# Altium project UCLA-DRS4-2.1.PrjPCB (part 7 of 7)

## Sheet I2C_ISOLATION.SchDoc: I2C ISOLATION
size OrCAD B; SheetNumber: 31; SheetTotal: 32
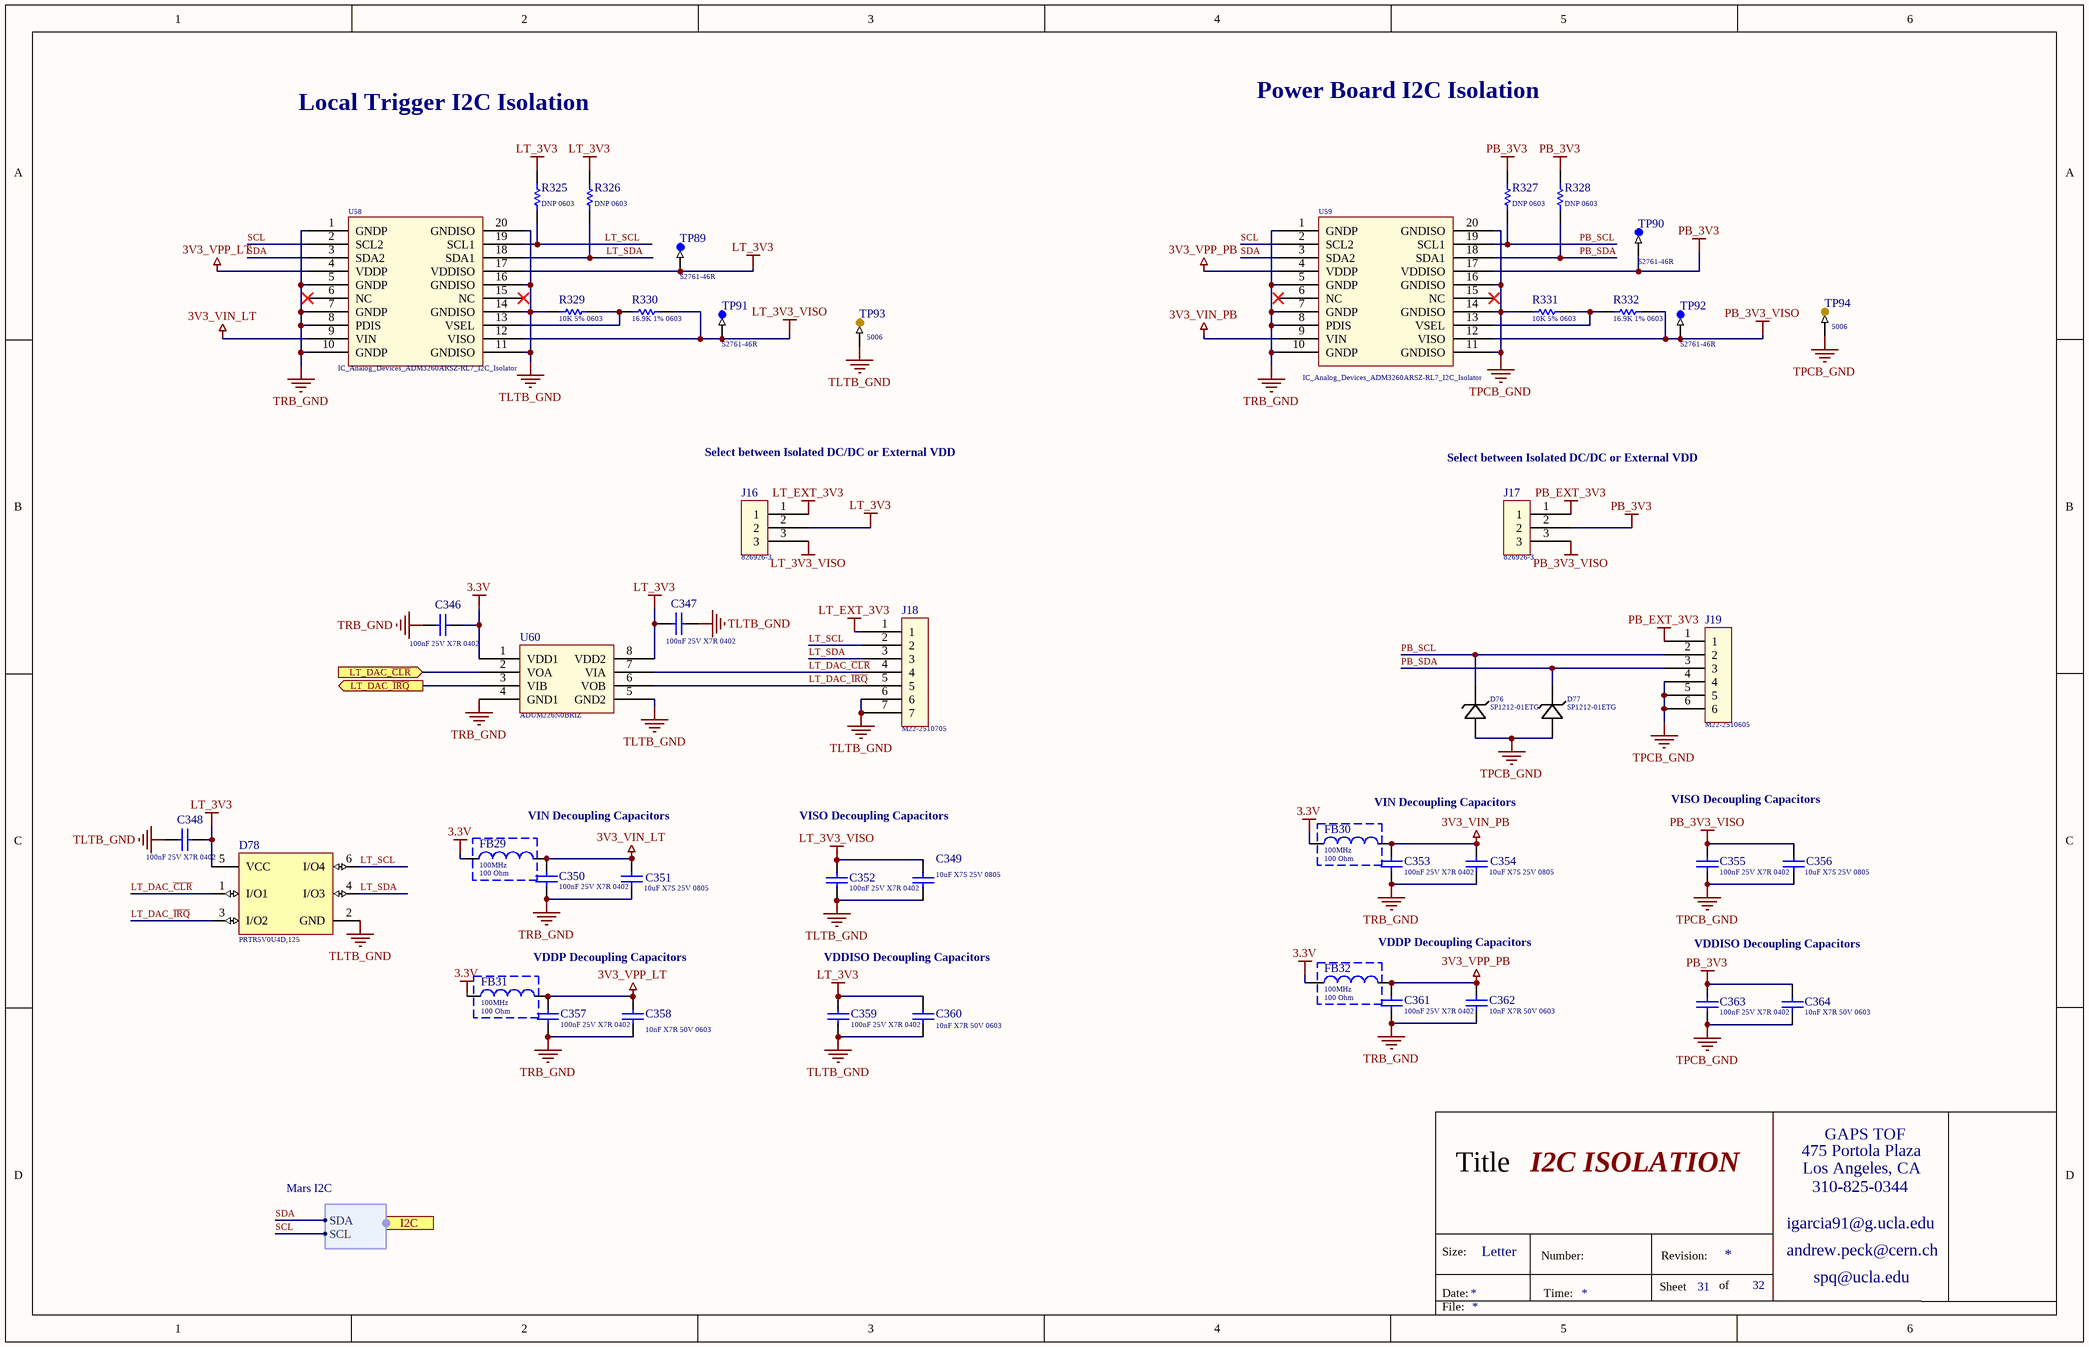
[diagram p29: I2C_ISOLATION.SchDoc]

### Parts
C346  Capacitance: 100nF 25V X7R 0402  [Cap_Taiyo_Yuden_TMK105B7104KV-FR_100nF]  (hidden comment: Cap_Taiyo_Yuden_TMK105B7104KV-FR_100nF)
C347  Capacitance: 100nF 25V X7R 0402  [Cap_Taiyo_Yuden_TMK105B7104KV-FR_100nF]  (hidden comment: Cap_Taiyo_Yuden_TMK105B7104KV-FR_100nF)
C348  Capacitance: 100nF 25V X7R 0402  [Cap_Taiyo_Yuden_TMK105B7104KV-FR_100nF]  (hidden comment: Cap_Taiyo_Yuden_TMK105B7104KV-FR_100nF)
C349  Capacitance: 10uF X7S 25V 0805  [Cap_Murata_ GRM21BC71E106ME11L_10uF]  (hidden comment: Cap_Murata_ GRM21BC71E106ME11L_10uF)
C350  Capacitance: 100nF 25V X7R 0402  [Cap_Taiyo_Yuden_TMK105B7104KV-FR_100nF]  (hidden comment: Cap_Taiyo_Yuden_TMK105B7104KV-FR_100nF)
C351  Capacitance: 10uF X7S 25V 0805  [Cap_Murata_ GRM21BC71E106ME11L_10uF]  (hidden comment: Cap_Murata_ GRM21BC71E106ME11L_10uF)
C352  Capacitance: 100nF 25V X7R 0402  [Cap_Taiyo_Yuden_TMK105B7104KV-FR_100nF]  (hidden comment: Cap_Taiyo_Yuden_TMK105B7104KV-FR_100nF)
C353  Capacitance: 100nF 25V X7R 0402  [Cap_Taiyo_Yuden_TMK105B7104KV-FR_100nF]  (hidden comment: Cap_Taiyo_Yuden_TMK105B7104KV-FR_100nF)
C354  Capacitance: 10uF X7S 25V 0805  [Cap_Murata_ GRM21BC71E106ME11L_10uF]  (hidden comment: Cap_Murata_ GRM21BC71E106ME11L_10uF)
C355  Capacitance: 100nF 25V X7R 0402  [Cap_Taiyo_Yuden_TMK105B7104KV-FR_100nF]  (hidden comment: Cap_Taiyo_Yuden_TMK105B7104KV-FR_100nF)
C356  Capacitance: 10uF X7S 25V 0805  [Cap_Murata_ GRM21BC71E106ME11L_10uF]  (hidden comment: Cap_Murata_ GRM21BC71E106ME11L_10uF)
C357  Capacitance: 100nF 25V X7R 0402  [Cap_Taiyo_Yuden_TMK105B7104KV-FR_100nF]  (hidden comment: Cap_Taiyo_Yuden_TMK105B7104KV-FR_100nF)
C358  Capacitance: 10nF X7R 50V 0603  [Kemet_C0603_0]  (hidden comment: Cap_Kemet_C0603C103J5RACTU_eec)
C359  Capacitance: 100nF 25V X7R 0402  [Cap_Taiyo_Yuden_TMK105B7104KV-FR_100nF]  (hidden comment: Cap_Taiyo_Yuden_TMK105B7104KV-FR_100nF)
C360  Capacitance: 10nF X7R 50V 0603  [Kemet_C0603_0]  (hidden comment: Cap_Kemet_C0603C103J5RACTU_eec)
C361  Capacitance: 100nF 25V X7R 0402  [Cap_Taiyo_Yuden_TMK105B7104KV-FR_100nF]  (hidden comment: Cap_Taiyo_Yuden_TMK105B7104KV-FR_100nF)
C362  Capacitance: 10nF X7R 50V 0603  [Kemet_C0603_0]  (hidden comment: Cap_Kemet_C0603C103J5RACTU_eec)
C363  Capacitance: 100nF 25V X7R 0402  [Cap_Taiyo_Yuden_TMK105B7104KV-FR_100nF]  (hidden comment: Cap_Taiyo_Yuden_TMK105B7104KV-FR_100nF)
C364  Capacitance: 10nF X7R 50V 0603  [Kemet_C0603_0]  (hidden comment: Cap_Kemet_C0603C103J5RACTU_eec)
D76  Series: SP1212-01ETG  [5V_ESD_Littlefuse_SP1212-01ETG_30kV]  (hidden comment: 5V_ESD_Littlefuse_SP1212-01ETG_30kV)
D77  Series: SP1212-01ETG  [5V_ESD_Littlefuse_SP1212-01ETG_30kV]  (hidden comment: 5V_ESD_Littlefuse_SP1212-01ETG_30kV)
D78  PRTR5V0U4D,125  [PRTR5V0U4D,125]
FB29  Measuring Frequency: 100MHz  Impedance: 100 Ohm  [FB_Wurth_Electronics_742792731_100Ohms]  (hidden comment: 742792731)
FB30  Measuring Frequency: 100MHz  Impedance: 100 Ohm  [FB_Wurth_Electronics_742792731_100Ohms]  (hidden comment: 742792731)
FB31  Measuring Frequency: 100MHz  Impedance: 100 Ohm  [FB_Wurth_Electronics_742792731_100Ohms]  (hidden comment: 742792731)
FB32  Measuring Frequency: 100MHz  Impedance: 100 Ohm  [FB_Wurth_Electronics_742792731_100Ohms]  (hidden comment: 742792731)
J16  Series: 826926-3  [Header_TE_Connectivity_826926-3_3POS_5A]  (hidden comment: Header_TE_Connectivity_826926-3_3POS_5A)
J17  Series: 826926-3  [Header_TE_Connectivity_826926-3_3POS_5A]  (hidden comment: Header_TE_Connectivity_826926-3_3POS_5A)
J18  Series: M22-2510705  [Header_Harwin_M22-2510705_7POS]  (hidden comment: Header_Harwin_M22-2510705_7POS)
J19  Series: M22-2510605  [Header_Harwin_ M22-2510605 _6POS]  (hidden comment: Header_Harwin_ M22-2510605 _6POS)
R325  Resistance: DNP 0603  [RES_DNP_0603]  (hidden comment: RES_DNP_0603)
R326  Resistance: DNP 0603  [RES_DNP_0603]  (hidden comment: RES_DNP_0603)
R327  Resistance: DNP 0603  [RES_DNP_0603]  (hidden comment: RES_DNP_0603)
R328  Resistance: DNP 0603  [RES_DNP_0603]  (hidden comment: RES_DNP_0603)
R329  10K 5% 0603  [RESC0603(1608)_L]
R330  Resistance: 16.9K 1% 0603  [Res_Panasonic_ERJ-3EKF1692V_16.9kOhm]  (hidden comment: Res_Panasonic_ERJ-3EKF1692V_16.9kOhm)
R331  10K 5% 0603  [RESC0603(1608)_L]
R332  Resistance: 16.9K 1% 0603  [Res_Panasonic_ERJ-3EKF1692V_16.9kOhm]  (hidden comment: Res_Panasonic_ERJ-3EKF1692V_16.9kOhm)
TP89  Series: S2761-46R  [TP_Harwin_S2761_46R]  (hidden comment: TP_Harwin_S2761_46R)
TP90  Series: S2761-46R  [TP_Harwin_S2761_46R]  (hidden comment: TP_Harwin_S2761_46R)
TP91  Series: S2761-46R  [TP_Harwin_S2761_46R]  (hidden comment: TP_Harwin_S2761_46R)
TP92  Series: S2761-46R  [TP_Harwin_S2761_46R]  (hidden comment: TP_Harwin_S2761_46R)
TP93  Series: 5006  [TP_Keystone_Electronics_5006]  (hidden comment: TP_Keystone_Electronics_5006)
TP94  Series: 5006  [TP_Keystone_Electronics_5006]  (hidden comment: TP_Keystone_Electronics_5006)
U58  IC_Analog_Devices_ADM3260ARSZ-RL7_I2C_Isolator  [IC_Analog_Devices_ADM3260ARSZ-RL7_I2C_Isolator]
U59  IC_Analog_Devices_ADM3260ARSZ-RL7_I2C_Isolator  [IC_Analog_Devices_ADM3260ARSZ-RL7_I2C_Isolator]
U60  Series: ADUM226N0BRIZ  [IC_Analog_Devices_ADUM226N0BRIZ_2CH_Isolator]  (hidden comment: IC_Analog_Devices_ADUM226N0BRIZ_2CH_Isolator)

### Ports
I2C (harness Mars I2C), LT_DAC_~{CLR} (in), LT_DAC_~{IRQ} (out)

### Harnesses
Mars I2C: SCL, SDA

### Nets
3.3V: C346.2 FB29.1 FB30.1 FB31.1 FB32.1 U60.1(VDD1)
3V3_VIN_LT: C350.2 C351.1 FB29.2 U58.9(VIN)
3V3_VIN_PB: C353.2 C354.1 FB30.2 U59.9(VIN)
3V3_VPP_LT: C357.2 C358.1 FB31.2 U58.4(VDDP)
3V3_VPP_PB: C361.2 C362.1 FB32.2 U59.4(VDDP)
LT_3V3: C347.2 C348.1 C359.2 C360.1 D78.5(VCC) J16.2 R325.1 R326.1 TP89.1 U58.17(VDDISO) U60.8(VDD2)
LT_3V3_VISO: C349.1 C352.2 J16.3 R330.1 TP91.1 U58.12(VISO)
LT_EXT_3V3: J16.1 J18.1
PB_3V3: C363.2 C364.1 J17.2 R327.1 R328.1 TP90.1 U59.17(VDDISO)
PB_3V3_VISO: C355.2 C356.1 J17.3 R332.1 TP92.1 U59.12(VISO)
PB_EXT_3V3: J17.1 J19.1
TLTB_GND: C347.1 C348.2 C349.2 C352.1 C359.1 C360.2 D78.2(GND) J18.6 J18.7 R329.1 TP93.1 U58.11(GNDISO) U58.14(GNDISO) U58.16(GNDISO) U58.20(GNDISO) U60.5(GND2)
TPCB_GND: C355.1 C356.2 C363.1 C364.2 D76.2 D77.2 J19.4 J19.5 J19.6 R331.1 TP94.1 U59.11(GNDISO) U59.14(GNDISO) U59.16(GNDISO) U59.20(GNDISO)
TRB_GND: C346.1 C350.1 C351.2 C353.1 C354.2 C357.1 C358.2 C361.1 C362.2 U58.1(GNDP) U58.5(GNDP) U58.7(GNDP) U58.8(PDIS) U58.10(GNDP) U59.1(GNDP) U59.5(GNDP) U59.7(GNDP) U59.8(PDIS) U59.10(GNDP) U60.4(GND1)
DAC_~{CLR}: U60.2(VOA) ; port LT_DAC_~{CLR}
DAC_~{IRQ}: U60.3(VIB) ; port LT_DAC_~{IRQ}
LT_DAC_~{CLR}: D78.1(I/O1) J18.4 U60.7(VIA)
LT_DAC_~{IRQ}: D78.3(I/O2) J18.5 U60.6(VOB)
LT_SCL: D78.6(I/O4) J18.2 R325.2 U58.19(SCL1)
LT_SDA: D78.4(I/O3) J18.3 R326.2 U58.18(SDA1)
PB_SCL: D76.1 J19.2 R327.2 U59.19(SCL1)
PB_SDA: D77.1 J19.3 R328.2 U59.18(SDA1)
SCL: U58.2(SCL2) U59.2(SCL2) ; port I2C.SCL
SDA: U58.3(SDA2) U59.3(SDA2) ; port I2C.SDA
NetR329_2: R329.2 R330.2 U58.13(VSEL)
NetR331_2: R331.2 R332.2 U59.13(VSEL)

Not connected (* = marked no-connect by the designer): U58 6(NC)* 15(NC)*; U59 6(NC)* 15(NC)*

### Notes on the sheet
- Local Trigger I2C Isolation
- Power Board I2C Isolation
- Select between Isolated DC/DC or External VDD
- (near J17) Select between Isolated DC/DC or External VDD
- VIN Decoupling Capacitors
- VISO Decoupling Capacitors
- VDDP Decoupling Capacitors
- VDDISO Decoupling Capacitors
- 475 Portola Plaza
- GAPS TOF
- Title
- igarcia91@g.ucla.edu
- Los Angeles, CA
- 310-825-0344
- Size:
- Date:
- Letter
- Number:
- Time:
- Sheet
- Revision:
- of
- andrew.peck@cern.ch
- spq@ucla.edu
- File:

### Library data of the parts
C346-C348 C350 C352 C353 C355 C357 C359 C361 C363 = Cap_Taiyo_Yuden_TMK105B7104KV-FR_100nF: CAP CER 100nF 25V X7R 0402; Supplier 1: Mouser; Supplier Part Number 1: 963-TMK105B7104KV-FR
C349 C351 C354 C356 = Cap_Murata_ GRM21BC71E106ME11L_10uF: CAP CER 10uF 25V X7R 0805; Supplier 1: Mouser; Supplier Part Number 1: 81-GRM21BC71E106ME1L
C358 C360 C362 C364 = Cap_Kemet_C0603C103J5RACTU_eec: CAP CER 10nF 50V X7R 0603; Manufacturer: Kemet; Mfg Package Ident: C0603; Part Number: C0603C103J5RACTU; helpURL: https://upverter.com/upn/revision/8a8d0c297e33ac74/; ComponentLink2Description: Datasheet; Temperature: -55°C to +125°C; Package: C0603; Supplier 2: Mouser; Price: 0.0184203126773; Supplier 1: Digi-Key; ComponentLink1URL: https://upverter.com/upn/revision/8a8d0c297e33ac74/; Supplier Part Number 2: 80-C0603C103J5R; Supplier Part Number 1: 399-1092-1-ND; Value: 10nF; ComponentLink1Description: Upverter; ComponentLink2URL: https://content.kemet.com/datasheets/KEM_C1002_X7R_SMD.pdf; RoHS: TRUE; Mouser Part Number: 80-C0603C103J5R; Temperature Range High: +125°C; Digikey Description: CAP CER 10000PF 50V X7R 0603; Digikey Part Number: 399-1092-1-ND; Lead Free: yes; Temperature Range Low: -55°C; Voltage: 50V
D76 D77 = 5V_ESD_Littlefuse_SP1212-01ETG_30kV: ESD Suppressors / TVS Diodes 5V 12A 30KV UNI-DIR; Supplier 1: Mouser; Supplier Part Number 1: 576-SP1212-01ETG
D78 = PRTR5V0U4D,125: as D45-D49 on sheet MARS_GPIO_MISC; Supplier 1: Mouser; Supplier Part Number 1: 771-PRTR5V0U4D-T/R
FB29-FB32 = FB_Wurth_Electronics_742792731_100Ohms: as FB22-FB27 on sheet Sensors; Supplier 1: Mouser; Supplier Part Number 1: 710-742792731
J16 J17 = Header_TE_Connectivity_826926-3_3POS_5A: Headers & Wire Housings 1X03 POS VERT TIN 5A; Supplier Part Number 1: 571-826926-3; Supplier 1: Mouser
J18 = Header_Harwin_M22-2510705_7POS: Headers & Wire Housings 6 WAY SIL VERT PC TAIL P/HDR; Supplier 1: Mouser; Supplier Part Number 1: 855-M22-2510705
J19 = Header_Harwin_ M22-2510605 _6POS: Headers & Wire Housings 6 WAY SIL VERT PC TAIL P/HDR; Supplier 1: Mouser; Supplier Part Number 1: 855-M22-2510605
R325-R328 = RES_DNP_0603: 0603 Do not place resistor
R329 R331 = CMP-1012-00098-1: as R208-R210 on sheet Sensors; Technology: SMT; Tolerance: 5 %; Power: 0.1 W
R330 R332 = Res_Panasonic_ERJ-3EKF1692V_16.9kOhm: RES SMD 16.9k OHM 5% 1/4W 0603; Supplier 1: Mouser; Supplier Part Number 1: 667-ERJ-3EKF1692V
TP89-TP92 = TP_Harwin_S2761_46R: Circuit Board Hardware - PCB SMT Mini Test Terminal, Reel; Supplier 1: Newark; Supplier Part Number 1: 76Y5391
TP93 TP94 = TP_Keystone_Electronics_5006: Circuit Board Hardware - PCB TEST POINT BLK .063; Supplier 1: Mouser; Supplier Part Number 1: 534-5006
U58 U59 = IC_Analog_Devices_ADM3260ARSZ-RL7_I2C_Isolator: Digital Isolators Isolated I2C & Power; Supplier Part Number 1: 584-ADM3260ARSZ-RL7; Supplier 1: Mouser
U60 = IC_Analog_Devices_ADUM226N0BRIZ_2CH_Isolator: Digital Isolators IC Robust Dual ISO 2:1 channel; Supplier 1: Mouser; Supplier Part Number 1: 584-ADUM226N0BRIZ

## Sheet I2C_MULTIPLEX.SchDoc: My title
size A3; Organization: University of California; Address1: 475 Portola Plaza; Address2: Los Angeles, CA 90095; Revision: R01; SheetNumber: 1; SheetTotal: 1
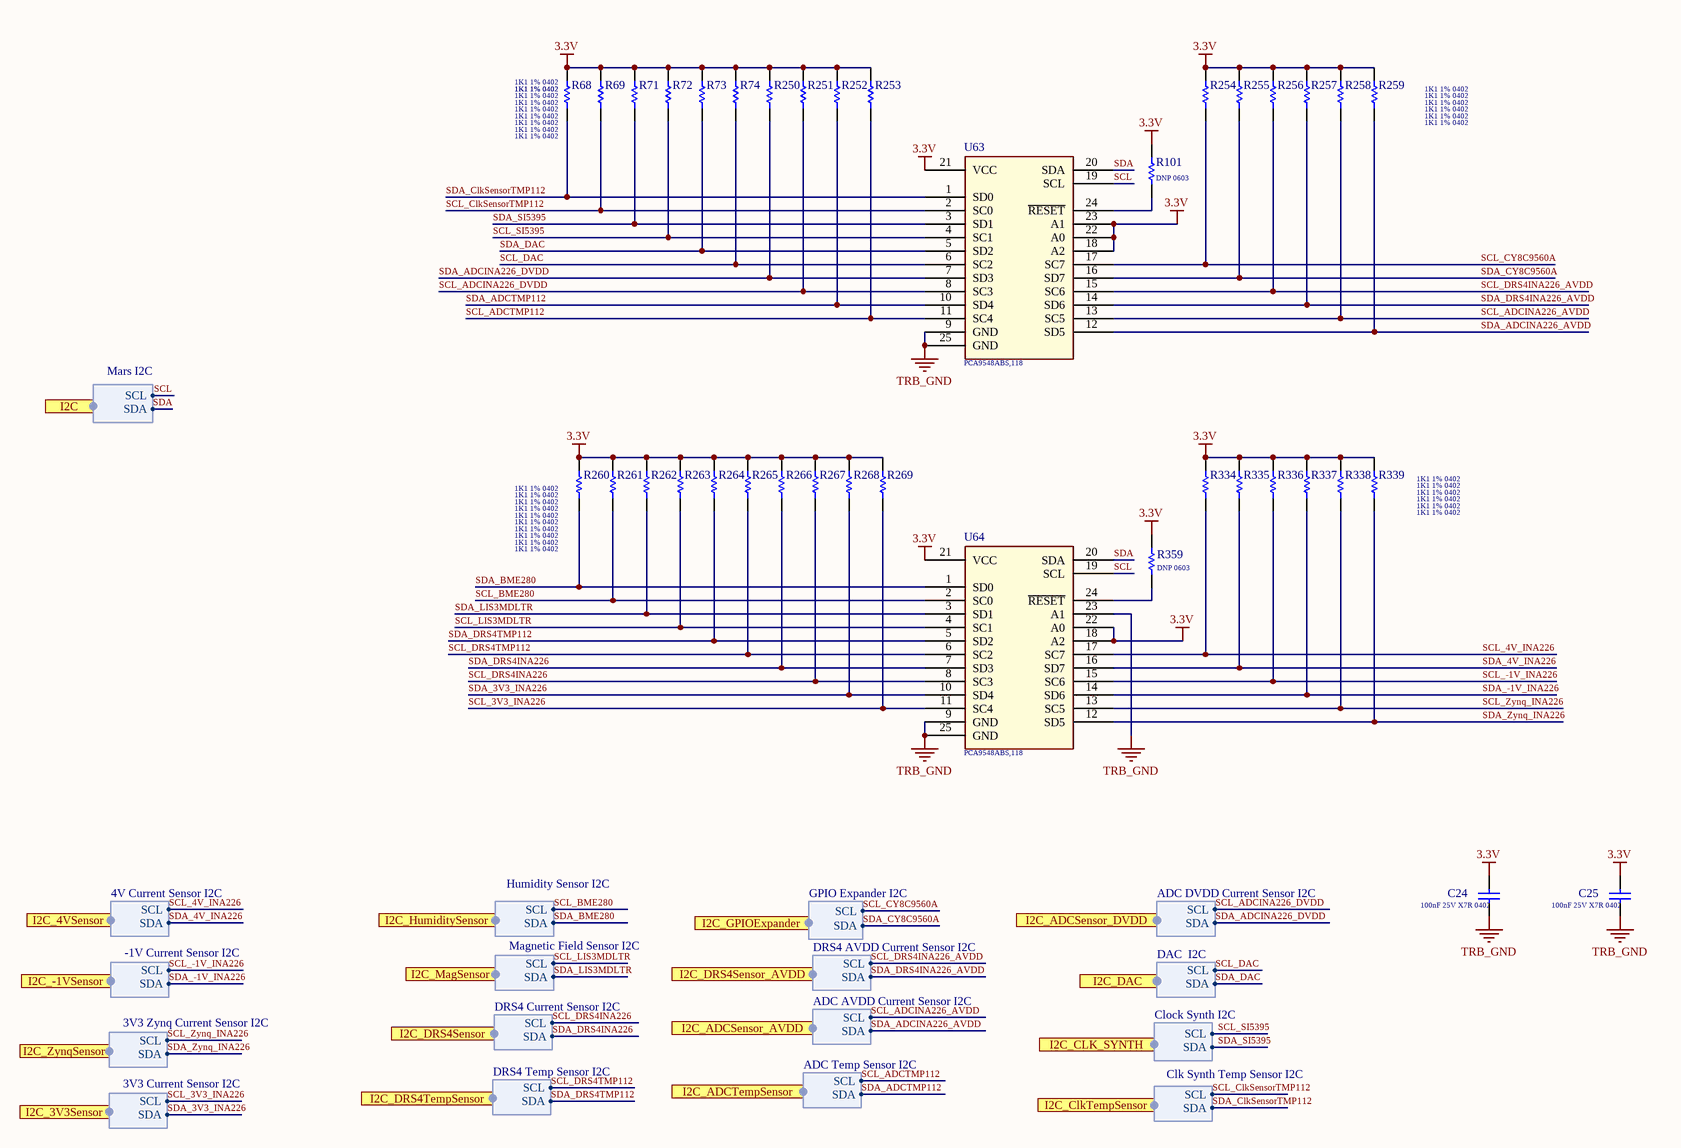
[diagram p30: I2C_MULTIPLEX.SchDoc]

### Parts
C24  Capacitance: 100nF 25V X7R 0402  [Cap_Taiyo_Yuden_TMK105B7104KV-FR_100nF]  (hidden comment: Cap_Taiyo_Yuden_TMK105B7104KV-FR_100nF)
C25  Capacitance: 100nF 25V X7R 0402  [Cap_Taiyo_Yuden_TMK105B7104KV-FR_100nF]  (hidden comment: Cap_Taiyo_Yuden_TMK105B7104KV-FR_100nF)
R68  1K1 1% 0402  [RESC0402(1005)_L]
R69  1K1 1% 0402  [RESC0402(1005)_L]
R71  1K1 1% 0402  [RESC0402(1005)_L]
R72  1K1 1% 0402  [RESC0402(1005)_L]
R73  1K1 1% 0402  [RESC0402(1005)_L]
R74  1K1 1% 0402  [RESC0402(1005)_L]
R101  Resistance: DNP 0603  [RES_DNP_0603]  (hidden comment: RES_DNP_0603)
R250  1K1 1% 0402  [RESC0402(1005)_L]
R251  1K1 1% 0402  [RESC0402(1005)_L]
R252  1K1 1% 0402  [RESC0402(1005)_L]
R253  1K1 1% 0402  [RESC0402(1005)_L]
R254  1K1 1% 0402  [RESC0402(1005)_L]
R255  1K1 1% 0402  [RESC0402(1005)_L]
R256  1K1 1% 0402  [RESC0402(1005)_L]
R257  1K1 1% 0402  [RESC0402(1005)_L]
R258  1K1 1% 0402  [RESC0402(1005)_L]
R259  1K1 1% 0402  [RESC0402(1005)_L]
R260  1K1 1% 0402  [RESC0402(1005)_L]
R261  1K1 1% 0402  [RESC0402(1005)_L]
R262  1K1 1% 0402  [RESC0402(1005)_L]
R263  1K1 1% 0402  [RESC0402(1005)_L]
R264  1K1 1% 0402  [RESC0402(1005)_L]
R265  1K1 1% 0402  [RESC0402(1005)_L]
R266  1K1 1% 0402  [RESC0402(1005)_L]
R267  1K1 1% 0402  [RESC0402(1005)_L]
R268  1K1 1% 0402  [RESC0402(1005)_L]
R269  1K1 1% 0402  [RESC0402(1005)_L]
R334  1K1 1% 0402  [RESC0402(1005)_L]
R335  1K1 1% 0402  [RESC0402(1005)_L]
R336  1K1 1% 0402  [RESC0402(1005)_L]
R337  1K1 1% 0402  [RESC0402(1005)_L]
R338  1K1 1% 0402  [RESC0402(1005)_L]
R339  1K1 1% 0402  [RESC0402(1005)_L]
R359  Resistance: DNP 0603  [RES_DNP_0603]  (hidden comment: RES_DNP_0603)
U63  Series: PCA9548ABS,118  [IC_NXP_PCA9548ABS,118_I2C_8Channel]  (hidden comment: IC_NXP_PCA9548ABS,118_I2C_8Channel)
U64  Series: PCA9548ABS,118  [IC_NXP_PCA9548ABS,118_I2C_8Channel]  (hidden comment: IC_NXP_PCA9548ABS,118_I2C_8Channel)

### Ports
I2C (harness Mars I2C), I2C_3V3Sensor (harness 3V3 Current Sensor I2C), I2C_4VSensor (harness 4V Current Sensor I2C), I2C_-1VSensor (harness -1V Current Sensor I2C), I2C_ADCSensor_AVDD (harness ADC AVDD Current Sensor I2C), I2C_ADCSensor_DVDD (harness ADC DVDD Current Sensor I2C), I2C_ADCTempSensor (harness ADC Temp Sensor I2C), I2C_CLK_SYNTH (harness Clock Synth I2C), I2C_ClkTempSensor (harness Clk Synth Temp Sensor I2C), I2C_DAC (harness DAC  I2C), I2C_DRS4Sensor (harness DRS4 Current Sensor I2C), I2C_DRS4Sensor_AVDD (harness DRS4 AVDD Current Sensor I2C), I2C_DRS4TempSensor (harness DRS4 Temp Sensor I2C), I2C_GPIOExpander (harness GPIO Expander I2C), I2C_HumiditySensor (harness Humidity Sensor I2C), I2C_MagSensor (harness Magnetic Field Sensor I2C), I2C_ZynqSensor (harness 3V3 Zynq Current Sensor I2C)

### Harnesses
Mars I2C: SCL, SDA
4V Current Sensor I2C: SCL, SDA
-1V Current Sensor I2C: SCL, SDA
3V3 Zynq Current Sensor I2C: SCL, SDA
3V3 Current Sensor I2C: SCL, SDA
Humidity Sensor I2C: SCL, SDA
Magnetic Field Sensor I2C: SCL, SDA
DRS4 Temp Sensor I2C: SCL, SDA
DRS4 Current Sensor I2C: SCL, SDA
DRS4 AVDD Current Sensor I2C: SCL, SDA
GPIO Expander I2C: SCL, SDA
ADC AVDD Current Sensor I2C: SCL, SDA
ADC Temp Sensor I2C: SCL, SDA
ADC DVDD Current Sensor I2C: SCL, SDA
DAC  I2C: SCL, SDA
Clock Synth I2C: SCL, SDA
Clk Synth Temp Sensor I2C: SCL, SDA

### Nets
3.3V: C24.2 C25.2 R68.2 R69.2 R71.2 R72.2 R73.2 R74.2 R101.1 R250.2 R251.2 R252.2 R253.2 R254.2 R255.2 R256.2 R257.2 R258.2 R259.2 R260.2 R261.2 R262.2 R263.2 R264.2 R265.2 R266.2 R267.2 R268.2 R269.2 R334.2 R335.2 R336.2 R337.2 R338.2 R339.2 R359.1 U63.18(A2) U63.21(VCC) U63.22(A0) U63.23(A1) U64.18(A2) U64.21(VCC) U64.22(A0)
TRB_GND: C24.1 C25.1 U63.9(GND) U63.25(GND) U64.9(GND) U64.23(A1) U64.25(GND)
SCL: U63.19(SCL) U64.19(SCL) ; port I2C.SCL
SCL_3V3_INA226: R269.1 U64.11(SC4) ; port I2C_3V3Sensor.SCL
SCL_4V_INA226: R334.1 U64.17(SC7) ; port I2C_4VSensor.SCL
SCL_-1V_INA226: R336.1 U64.15(SC6) ; port I2C_-1VSensor.SCL
SCL_ADCINA226_AVDD: R258.1 U63.13(SC5) ; port I2C_ADCSensor_AVDD.SCL
SCL_ADCINA226_DVDD: R251.1 U63.8(SC3) ; port I2C_ADCSensor_DVDD.SCL
SCL_ADCTMP112: R253.1 U63.11(SC4) ; port I2C_ADCTempSensor.SCL
SCL_BME280: R261.1 U64.2(SC0) ; port I2C_HumiditySensor.SCL
SCL_ClkSensorTMP112: R69.1 U63.2(SC0) ; port I2C_ClkTempSensor.SCL
SCL_CY8C9560A: R254.1 U63.17(SC7) ; port I2C_GPIOExpander.SCL
SCL_DAC: R74.1 U63.6(SC2) ; port I2C_DAC.SCL
SCL_DRS4INA226: R267.1 U64.8(SC3) ; port I2C_DRS4Sensor.SCL
SCL_DRS4INA226_AVDD: R256.1 U63.15(SC6) ; port I2C_DRS4Sensor_AVDD.SCL
SCL_DRS4TMP112: R265.1 U64.6(SC2) ; port I2C_DRS4TempSensor.SCL
SCL_LIS3MDLTR: R263.1 U64.4(SC1) ; port I2C_MagSensor.SCL
SCL_SI5395: R72.1 U63.4(SC1) ; port I2C_CLK_SYNTH.SCL
SCL_Zynq_INA226: R338.1 U64.13(SC5) ; port I2C_ZynqSensor.SCL
SDA: U63.20(SDA) U64.20(SDA) ; port I2C.SDA
SDA_3V3_INA226: R268.1 U64.10(SD4) ; port I2C_3V3Sensor.SDA
SDA_4V_INA226: R335.1 U64.16(SD7) ; port I2C_4VSensor.SDA
SDA_-1V_INA226: R337.1 U64.14(SD6) ; port I2C_-1VSensor.SDA
SDA_ADCINA226_AVDD: R259.1 U63.12(SD5) ; port I2C_ADCSensor_AVDD.SDA
SDA_ADCINA226_DVDD: R250.1 U63.7(SD3) ; port I2C_ADCSensor_DVDD.SDA
SDA_ADCTMP112: R252.1 U63.10(SD4) ; port I2C_ADCTempSensor.SDA
SDA_BME280: R260.1 U64.1(SD0) ; port I2C_HumiditySensor.SDA
SDA_ClkSensorTMP112: R68.1 U63.1(SD0) ; port I2C_ClkTempSensor.SDA
SDA_CY8C9560A: R255.1 U63.16(SD7) ; port I2C_GPIOExpander.SDA
SDA_DAC: R73.1 U63.5(SD2) ; port I2C_DAC.SDA
SDA_DRS4INA226: R266.1 U64.7(SD3) ; port I2C_DRS4Sensor.SDA
SDA_DRS4INA226_AVDD: R257.1 U63.14(SD6) ; port I2C_DRS4Sensor_AVDD.SDA
SDA_DRS4TMP112: R264.1 U64.5(SD2) ; port I2C_DRS4TempSensor.SDA
SDA_LIS3MDLTR: R262.1 U64.3(SD1) ; port I2C_MagSensor.SDA
SDA_SI5395: R71.1 U63.3(SD1) ; port I2C_CLK_SYNTH.SDA
SDA_Zynq_INA226: R339.1 U64.12(SD5) ; port I2C_ZynqSensor.SDA
NetR101_2: R101.2 U63.24(~{RESET})
NetR359_2: R359.2 U64.24(~{RESET})

### Notes on the sheet
- 475 Portola Plaza
- GAPS TOF
- igarcia91@g.ucla.edu
- Los Angeles, CA
- 310-825-0344
- Size:
- Date:
- Letter
- Number:
- Time:
- Sheet
- Revision:
- of
- andrew.peck@cern.ch
- spq@ucla.edu
- File:

### Library data of the parts
C24 C25 = Cap_Taiyo_Yuden_TMK105B7104KV-FR_100nF: CAP CER 100nF 25V X7R 0402; Supplier 1: Mouser; Supplier Part Number 1: 963-TMK105B7104KV-FR
R68 R69 R71-R74 R250-R269 R334-R339 = CMP-1011-00514-1: 1K1 0.063W 1% 0402 (1005 Metric)  SMD; Case-Metric: 1005; Case-EIA: 0402; Value: 1100.00 Ohm; Power: 0.063 W; Tolerance: 1 %; Technology: SMT
R101 R359 = RES_DNP_0603: 0603 Do not place resistor
U63 U64 = IC_NXP_PCA9548ABS,118_I2C_8Channel: Multiplexer Switch ICs 8CH I2C SWTCH W/REST; Supplier Part Number 1: 771-PCA9548ABS118; Supplier 1: Mouser

## Sheet 1V8_SUPPLY.SchDoc: My title
size A3; Organization: University of California; Address1: 475 Portola Plaza; Address2: Los Angeles, CA 90095; Revision: R01; SheetNumber: 1; SheetTotal: 1
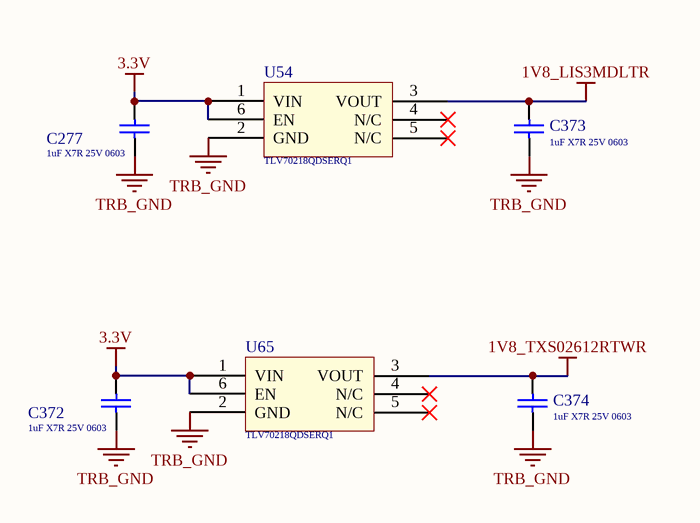
[diagram p31: 1V8_SUPPLY.SchDoc]

### Parts
C277  Capacitance: 1uF X7R 25V 0603  [Cap_Murata_GCJ188R71E105KA01J_1uF]  (hidden comment: Cap_Murata_GCJ188R71E105KA01J_1uF)
C372  Capacitance: 1uF X7R 25V 0603  [Cap_Murata_GCJ188R71E105KA01J_1uF]  (hidden comment: Cap_Murata_GCJ188R71E105KA01J_1uF)
C373  Capacitance: 1uF X7R 25V 0603  [Cap_Murata_GCJ188R71E105KA01J_1uF]  (hidden comment: Cap_Murata_GCJ188R71E105KA01J_1uF)
C374  Capacitance: 1uF X7R 25V 0603  [Cap_Murata_GCJ188R71E105KA01J_1uF]  (hidden comment: Cap_Murata_GCJ188R71E105KA01J_1uF)
U54  Series: TLV70218QDSERQ1  [LDO_Texas_Instruments_TLV70218QDSERQ1_300mA]  (hidden comment: LDO_Texas_Instruments_TLV70218QDSERQ1_300mA)
U65  Series: TLV70218QDSERQ1  [LDO_Texas_Instruments_TLV70218QDSERQ1_300mA]  (hidden comment: LDO_Texas_Instruments_TLV70218QDSERQ1_300mA)

### Nets
1V8_LIS3MDLTR: C373.2 U54.3(VOUT)
1V8_TXS02612RTWR: C374.2 U65.3(VOUT)
3.3V: C277.2 C372.2 U54.1(VIN) U54.6(EN) U65.1(VIN) U65.6(EN)
TRB_GND: C277.1 C372.1 C373.1 C374.1 U54.2(GND) U65.2(GND)

Not connected (* = marked no-connect by the designer): U54 4(N/C)* 5(N/C)*; U65 4(N/C)* 5(N/C)*

### Notes on the sheet
- 475 Portola Plaza
- GAPS TOF
- igarcia91@g.ucla.edu
- Los Angeles, CA
- 310-825-0344
- Size:
- Date:
- Letter
- Number:
- Time:
- Sheet
- Revision:
- of
- andrew.peck@cern.ch
- spq@ucla.edu
- File:

### Library data of the parts
C277 C372-C374 = Cap_Murata_GCJ188R71E105KA01J_1uF: CAP CER 1uF 25V X7R 0603; Supplier 1: Mouser; Supplier Part Number 1: 81-GCJ188R71E105KA1J
U54 U65 = LDO_Texas_Instruments_TLV70218QDSERQ1_300mA: LDO Voltage Regulators 300mA Low; Supplier 1: Mouser; Supplier Part Number 1: 595-TLV70218QDSERQ1

## Sheet COVER.SchDoc: My title
size A3; Organization: University of California; Address1: 475 Portola Plaza; Address2: Los Angeles, CA 90095; Revision: R01; SheetNumber: 1; SheetTotal: 1
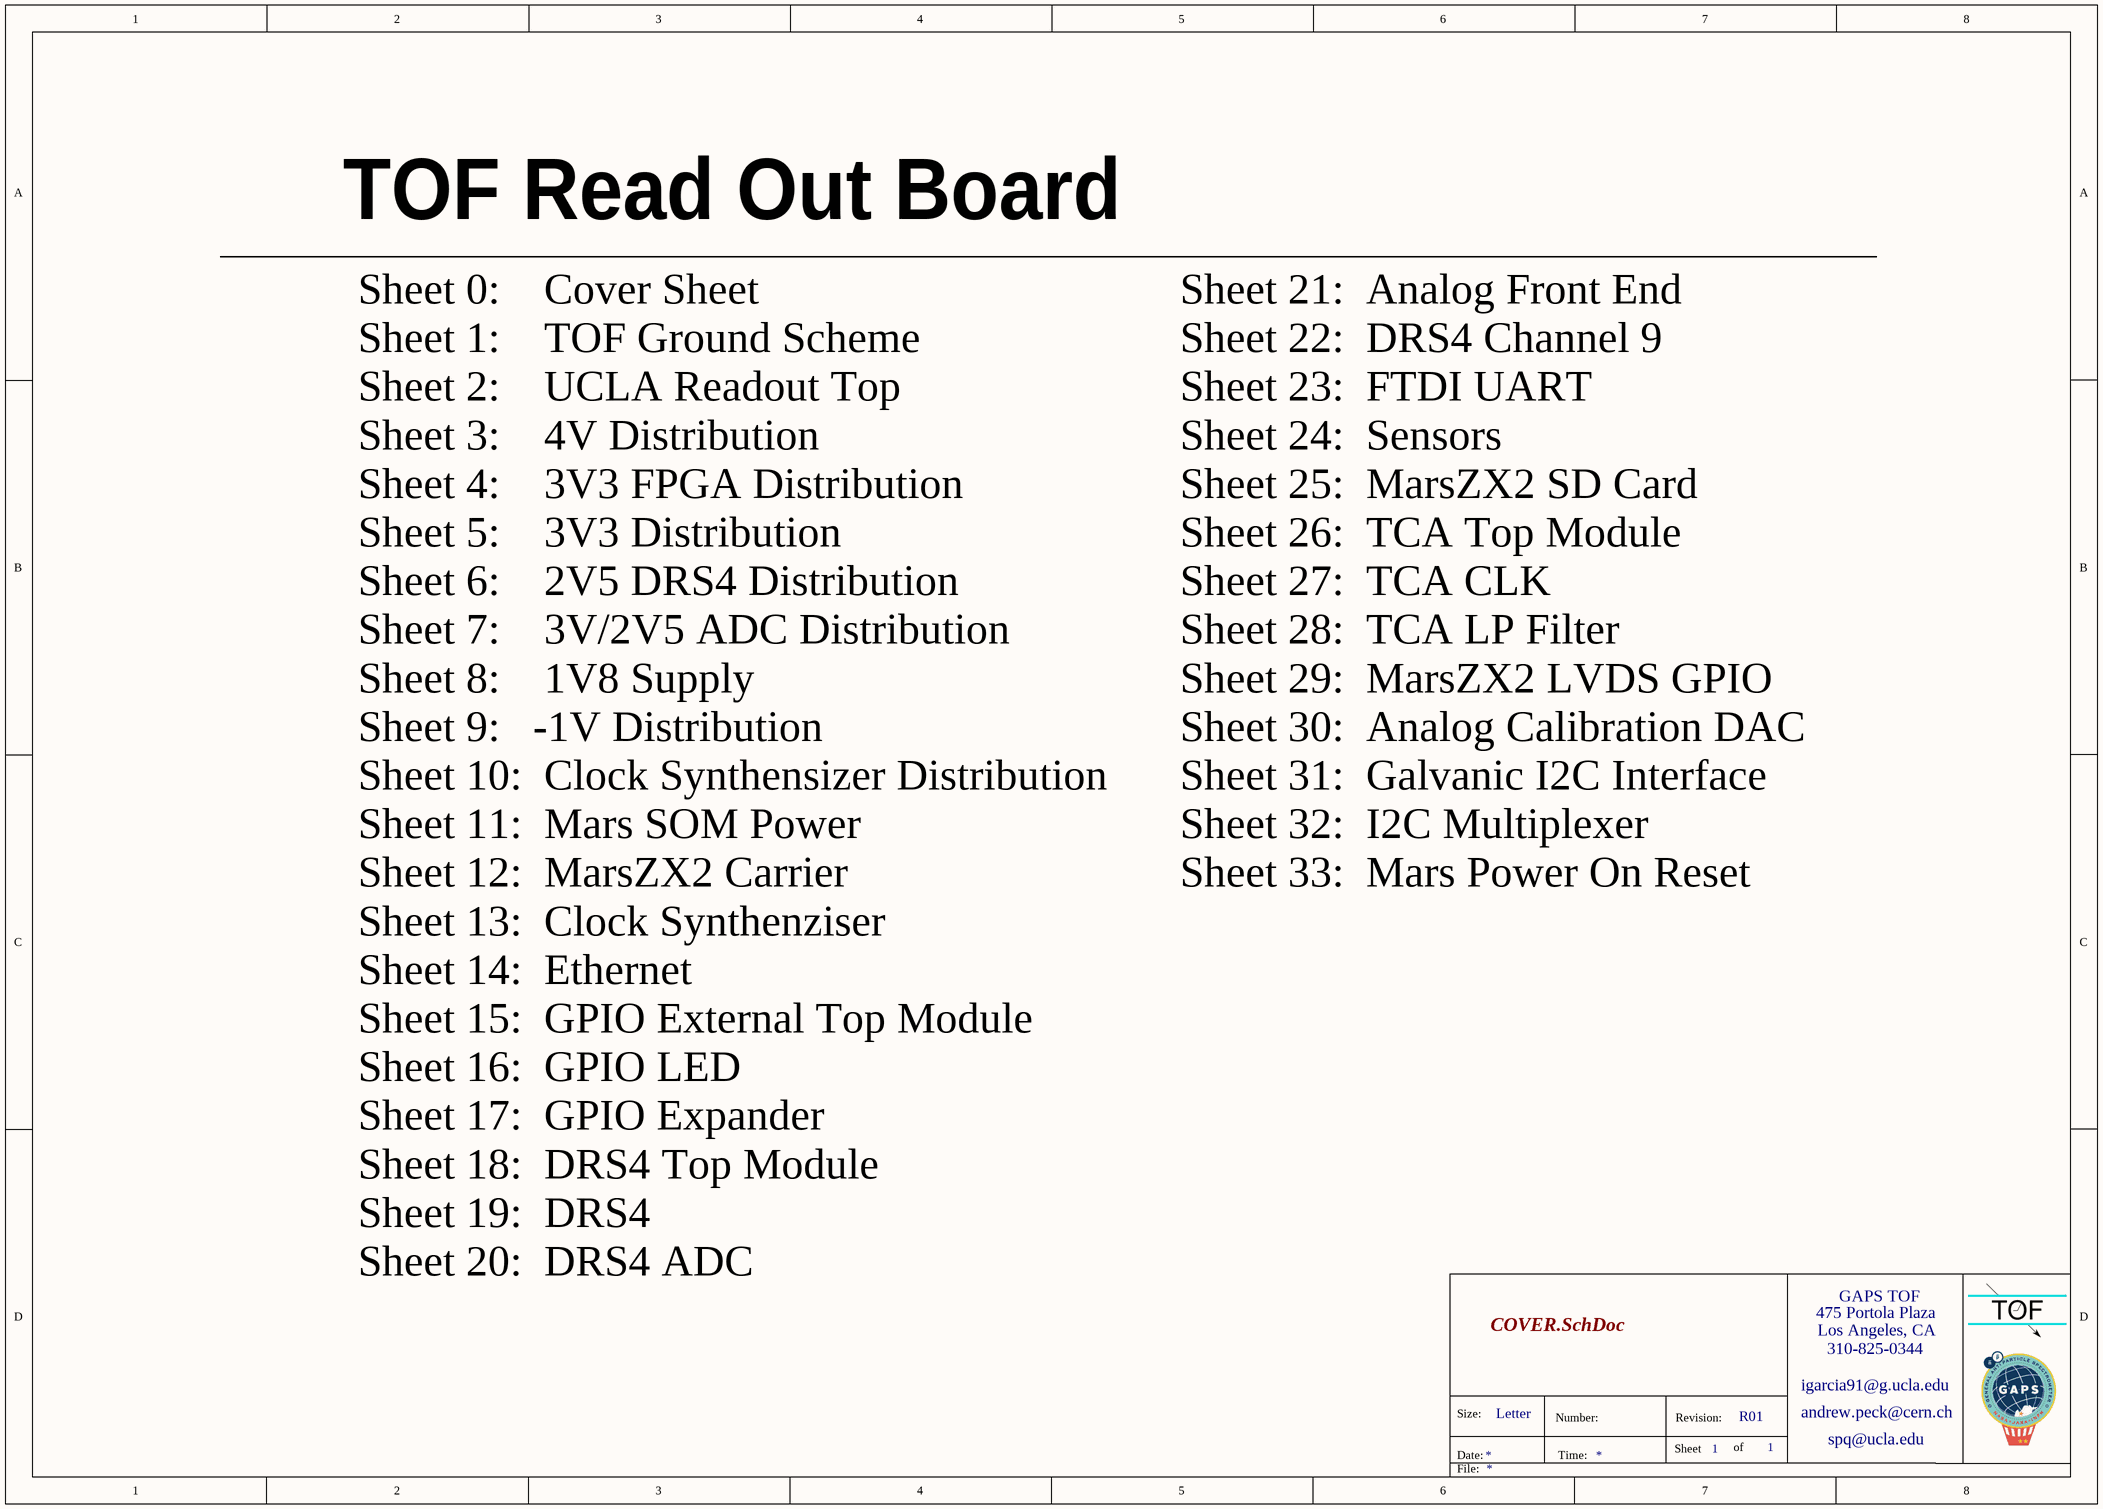
[diagram p32: COVER.SchDoc]

### Notes on the sheet
- TOF Read Out Board
- Sheet 21:  Analog Front End
  Sheet 22:  DRS4 Channel 9
  Sheet 23:  FTDI UART
  Sheet 24:  Sensors
  Sheet 25:  MarsZX2 SD Card
  Sheet 26:  TCA Top Module
  Sheet 27:  TCA CLK
  Sheet 28:  TCA LP Filter
  Sheet 29:  MarsZX2 LVDS GPIO
  Sheet 30:  Analog Calibration DAC
  Sheet 31:  Galvanic I2C Interface
  Sheet 32:  I2C Multiplexer
  Sheet 33:  Mars Power On Reset
- Sheet 0:    Cover Sheet
  Sheet 1:    TOF Ground Scheme
  Sheet 2:    UCLA Readout Top
  Sheet 3:    4V Distribution
  Sheet 4:    3V3 FPGA Distribution
  Sheet 5:    3V3 Distribution
  Sheet 6:    2V5 DRS4 Distribution
  Sheet 7:    3V/2V5 ADC Distribution
  Sheet 8:    1V8 Supply
  Sheet 9:   -1V Distribution
  Sheet 10:  Clock Synthensizer Distribution
  Sheet 11:  Mars SOM Power
  Sheet 12:  MarsZX2 Carrier
  Sheet 13:  Clock Synthenziser
  Sheet 14:  Ethernet
  Sheet 15:  GPIO External Top Module
  Sheet 16:  GPIO LED
  Sheet 17:  GPIO Expander
  Sheet 18:  DRS4 Top Module
  Sheet 19:  DRS4
  Sheet 20:  DRS4 ADC
- 475 Portola Plaza
- GAPS TOF
- igarcia91@g.ucla.edu
- Los Angeles, CA
- 310-825-0344
- Size:
- Date:
- Letter
- Number:
- Time:
- Sheet
- Revision:
- of
- andrew.peck@cern.ch
- spq@ucla.edu
- File:

## Sheet TOF_GND_SCHEME.SchDoc: TOF GND Scheme
size OrCAD B; SheetNumber: 1; SheetTotal: 32
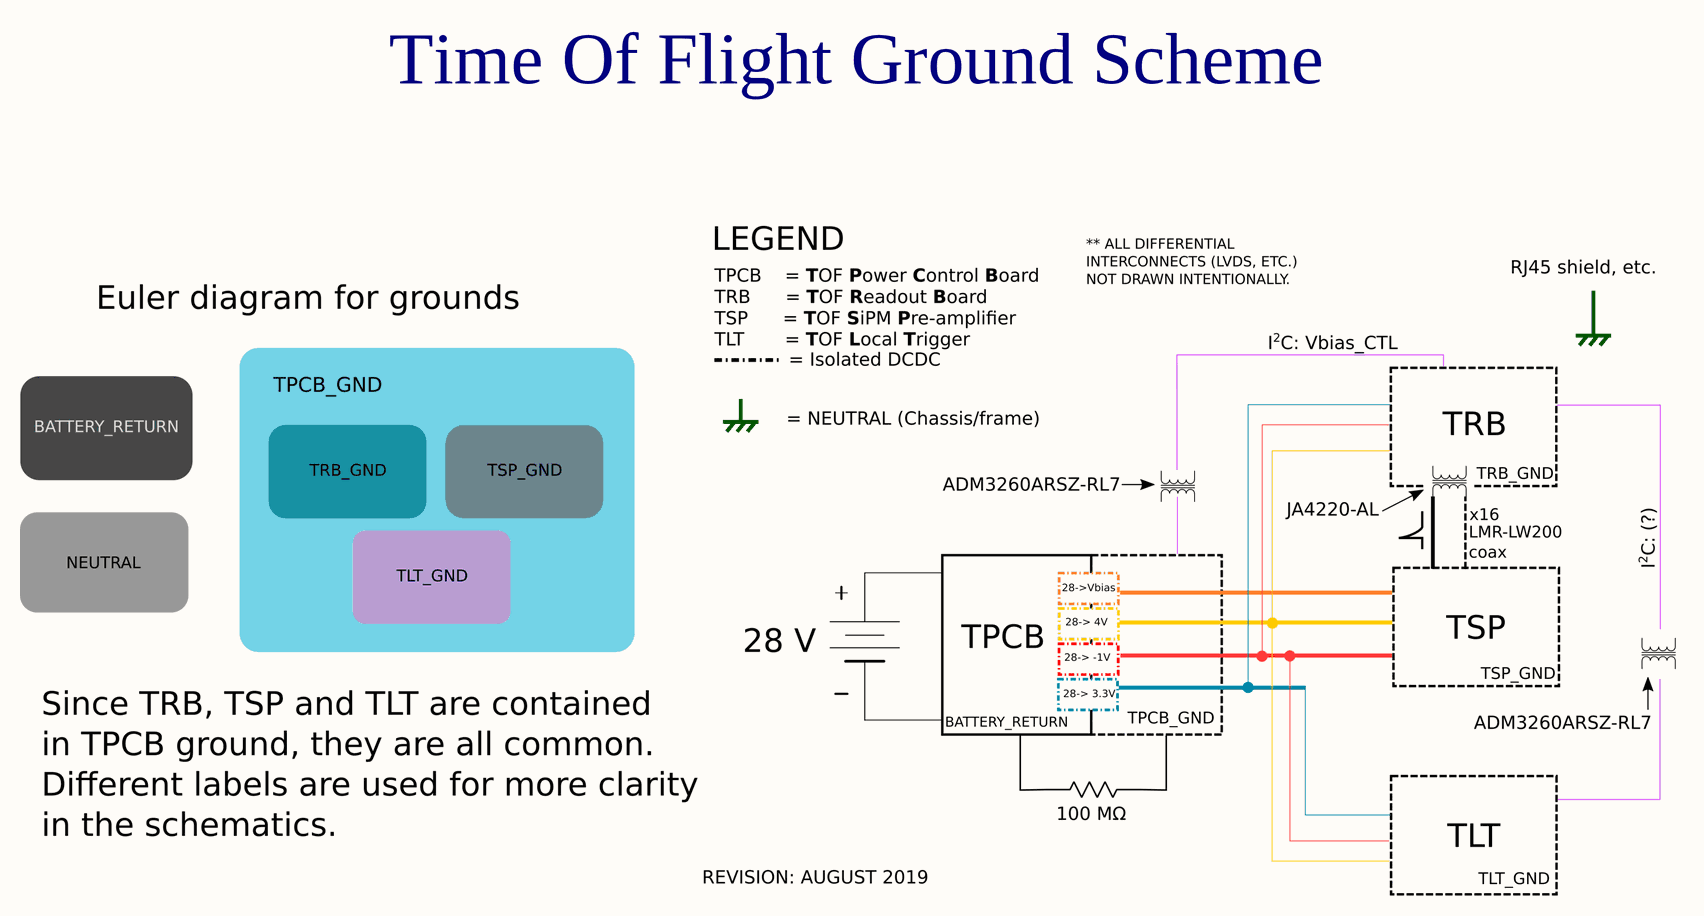
[diagram p33: TOF_GND_SCHEME.SchDoc]

### Notes on the sheet
- Time Of Flight Ground Scheme
- 475 Portola Plaza
- GAPS TOF
- Title
- igarcia91@g.ucla.edu
- Los Angeles, CA
- 310-825-0344
- Size:
- Date:
- Letter
- Number:
- Time:
- Sheet
- Revision:
- of
- andrew.peck@cern.ch
- spq@ucla.edu
- File:

## Nets that join several sheets
1V8_LIS3MDLTR: Sensors (C273.2 U50.6), 1V8_SUPPLY (C373.2 U54.3)
1V8_TXS02612RTWR: MARS_MIO (C274.1 U53.5), 1V8_SUPPLY (C374.2 U65.3)
2V5_ADC_DIG: DRS4_ADC (R125.1 U41.8), 3V_ADC_SUPPLY (C33.2 TP21.1 U9.4)
2V5_DRS_ANA: DRS4 (R102.1 U37.8), 2V5_DRS4_SUPPLY (C12.2 TP10.1 U4.4)
3.3V: DRS4 (16 pins), DRS-Module 0/FE0 (FB19A.1), DRS4_ADC (14 pins), DRS-Module 0/FE2 (FB19B.1), DRS-Module 0/FE4 (FB19C.1), DRS-Module 0/FE6 (FB19D.1), DRS-Module 0/FE1 (FB19E.1), DRS-Module 0/FE3 (FB19F.1), DRS-Module 0/FE5 (FB19G.1), DRS-Module 0/FE7 (FB19H.1), ANA_FE_CLK_SYNTH (FB35.1), MarsCarrier (D21.5), ENET (5 pins), DAC (FB1.1 FB8.1 FB13.1 FB14.1), CLK_SYNTH (5 pins), TCA_CLK_DIST (6 pins), MARS_MIO (FB12.1), CLK_PWR (20 pins), 2V5_DRS4_SUPPLY (C10.2 D5.1 R7.1 U4.2), 3V_ADC_SUPPLY (8 pins), MarsCarrier_PWR (6 pins), 3_3V_DIST (C8.1 C9.1 FB4.2 TP8.1), Sensors (18 pins), MARS_GPIO_MISC (11 pins), DRS4_GPIO_EXPANDER (8 pins), GPIO_EXPANDER_LED (J15.1), I2C_ISOLATION (6 pins), I2C_MULTIPLEX (43 pins), 1V8_SUPPLY (6 pins)
3V_ADC_ANA: DRS4_ADC (R144.1 U43.8), 3V_ADC_SUPPLY (C29.2 TP19.1 U8.4)
4V: DRS-Module 0/FE0 (FB17A.1), DRS-Module 0/FE2 (FB17B.1), DRS-Module 0/FE4 (FB17C.1), DRS-Module 0/FE6 (FB17D.1), DRS-Module 0/FE1 (FB17E.1), DRS-Module 0/FE3 (FB17F.1), DRS-Module 0/FE5 (FB17G.1), DRS-Module 0/FE7 (FB17H.1), ANA_FE_CLK_SYNTH (FB20.1), 4V_DIST (C4.1 C5.1 FB2.2 TP2.1), -1V_DIST (R14.1), Sensors (U48.8)
+3V3_IN: ToF (D1.1 J2.1), 3_3V_DIST (F3.1 TP7.1)
+3V3_SPM15: ToF (D2.1 J2.3), 3V3_DIST_ZYNQ (F2.1 TP5.1)
+4V_IN: ToF (D4.1 J2.7), 4V_DIST (F1.1 TP1.1)
-1V: DRS-Module 0/FE0 (FB18A.1), DRS-Module 0/FE2 (FB18B.1), DRS-Module 0/FE4 (FB18C.1), DRS-Module 0/FE6 (FB18D.1), DRS-Module 0/FE1 (FB18E.1), DRS-Module 0/FE3 (FB18F.1), DRS-Module 0/FE5 (FB18G.1), DRS-Module 0/FE7 (FB18H.1), ANA_FE_CLK_SYNTH (FB21.1), -1V_DIST (C35.2 C36.2 FB5.2 TP24.1)
-1V_IN: ToF (D3.1 J2.5), -1V_DIST (F4.1 TP23.1)
CLK_VDD_1V8: CLK_SYNTH (6 pins), CLK_PWR (C38.2 TP26.1 U11.4)
CLK_VDDA_3V3: CLK_SYNTH (C94.2 FB7.1), CLK_PWR (C50.2 TP32.1 U14.5)
CLK_VDDO_2V5: CLK_SYNTH (10 pins), CLK_PWR (C41.2 TP28.1 U12.4)
CLK_VDDO_3V3: CLK_SYNTH (5 pins), CLK_PWR (C46.2 TP30.1 U13.5)
CLK_VDDS_3V3: CLK_SYNTH (C93.1 L1.2 R61.2), CLK_PWR (C53.2 TP34.1 U15.5)
DRS4_2V5_ADM: DRS4 (J4.2), 2V5_DRS4_SUPPLY (C21.2 U7.5 U7.7 U7.8)
DRS4_2V5_MIC: DRS4 (J5.2), 2V5_DRS4_SUPPLY (5 pins)
DRS4_2V5_TPS: DRS4 (J3.2), 2V5_DRS4_SUPPLY (C14.2 D6.1 R8.1 U5.2)
DRS4_DVDD: DRS4 (20 pins), 2V5_DRS4_SUPPLY (13 pins)
NEUTRAL: ToF (J1.9 J1.10), ENET (T1.S1 T1.S2), MARS_FTDI (J12.6)
TRB_GND: ToF (8 pins), DRS4 (68 pins), DRS-Module 0/FE0 (36 pins), DRS4_ADC (42 pins), DRS-Module 0/FE2 (36 pins), DRS-Module 0/FE4 (36 pins), DRS-Module 0/FE6 (36 pins), DRS-Module 0/FE1 (36 pins), DRS-Module 0/FE3 (36 pins), DRS-Module 0/FE5 (36 pins), DRS-Module 0/FE7 (36 pins), ANA_FE_CLK_SYNTH (38 pins), MarsCarrier (46 pins), ENET (9 pins), DAC (27 pins), CLK_SYNTH (26 pins), TCA_CLK_DIST (10 pins), TCA_LP_FILTER (54 pins), MARS_MIO (31 pins), CLK_PWR (32 pins), 2V5_DRS4_SUPPLY (27 pins), 4V_DIST (C4.2 C5.2 R2.1 TP3.1), -1V_DIST (C35.1 C36.1 TP25.1), 3V_ADC_SUPPLY (14 pins), MarsCarrier_PWR (50 pins), MARS_PORB (16 pins), 3V3_DIST_ZYNQ (C6.2 C7.2 R4.1 TP6.1), 3_3V_DIST (C8.2 C9.2 R6.1 TP9.1), Sensors (28 pins), MARS_GPIO_MISC (35 pins), MARS_FTDI (25 pins), DRS4_GPIO_EXPANDER (11 pins), GPIO_EXPANDER_LED (24 pins), I2C_ISOLATION (20 pins), I2C_MULTIPLEX (7 pins), 1V8_SUPPLY (6 pins)
VCC_1V8_PS: MarsCarrier (11 pins), MarsCarrier_PWR (5 pins)
VCC_3V3: MarsCarrier (9 pins), MarsCarrier_PWR (8 pins), MARS_PORB (J21.2 J22.1), 3V3_DIST_ZYNQ (C6.1 C7.1 FB3.2 TP4.1)
VCC_IO_B34: MarsCarrier (6 pins), MarsCarrier_PWR (15 pins)
3V3_SENSE_N: 3_3V_DIST (R5.3), Sensors (R199.2)
3V3_SENSE_P: 3_3V_DIST (R5.4), Sensors (R205.2)
3V3_ZYNQ_SENSE_N: MarsCarrier_PWR (R20.1), 3V3_DIST_ZYNQ (R3.3)
3V3_ZYNQ_SENSE_P: MarsCarrier_PWR (R24.1), 3V3_DIST_ZYNQ (R3.4)
4V_SENSE_N: 4V_DIST (R1.3), Sensors (R200.2)
4V_SENSE_P: 4V_DIST (R1.4), Sensors (R206.2)
-1V_SENSE_N: -1V_DIST (R13.4), Sensors (R201.2)
-1V_SENSE_P: -1V_DIST (R13.3), Sensors (R207.2)
ADC_CLK: DRS4_ADC (R126.2 U40.2), CLK_SYNTH (R50.1)
BIAS: DRS4 (R108.1), DAC (TP78.1 U56.9)
BOOT_MODE: MarsCarrier (J7.190), MarsCarrier_PWR (J6.2)
CLK_SYNTH_8: ANA_FE_CLK_SYNTH (C245.2 L6.1), CLK_SYNTH (R51.1)
DAC_~{CLR}: DRS4_GPIO_EXPANDER (U20.5), I2C_ISOLATION (U60.2)
DAC_~{IRQ}: DRS4_GPIO_EXPANDER (U20.4), I2C_ISOLATION (U60.3)
DRS4~{_RESET}: DRS4 (R35.1 U36.35), MarsCarrier (J7.93)
DRS4_A0: DRS4 (R217.1 U36.31), MarsCarrier (J7.99)
DRS4_A1: DRS4 (R218.1 U36.32), MarsCarrier (J7.97)
DRS4_A2: DRS4 (R307.2 U36.60), MarsCarrier (J7.35)
DRS4_A3: DRS4 (R308.1 U36.61), MarsCarrier (J7.31)
DRS4_DENABLE: DRS4 (R31.1 R113.2 U36.74), MarsCarrier (J7.19)
DRS4_DTAP: DRS4 (R343.1 U36.62), MarsCarrier (J7.29)
DRS4_DWRITE: DRS4 (R33.1 R114.2 U36.73), MarsCarrier (J7.23)
DRS4_IN0_N: DRS4 (R168.2 U36.4), DRS-Module 0/FE0 (R161A.2 R167A.2)
DRS4_IN0_P: DRS4 (R168.1 U36.3), DRS-Module 0/FE0 (R160A.2 R166A.2)
DRS4_IN1_N: DRS4 (R169.2 U36.6), DRS-Module 0/FE1 (R161E.2 R167E.2)
DRS4_IN1_P: DRS4 (R169.1 U36.5), DRS-Module 0/FE1 (R160E.2 R166E.2)
DRS4_IN2_N: DRS4 (R184.2 U36.8), DRS-Module 0/FE2 (R161B.2 R167B.2)
DRS4_IN2_P: DRS4 (R184.1 U36.7), DRS-Module 0/FE2 (R160B.2 R166B.2)
DRS4_IN3_N: DRS4 (R185.2 U36.10), DRS-Module 0/FE3 (R161F.2 R167F.2)
DRS4_IN3_P: DRS4 (R185.1 U36.9), DRS-Module 0/FE3 (R160F.2 R166F.2)
DRS4_IN4_N: DRS4 (R345.2 U36.12), DRS-Module 0/FE4 (R161C.2 R167C.2)
DRS4_IN4_P: DRS4 (R345.1 U36.11), DRS-Module 0/FE4 (R160C.2 R166C.2)
DRS4_IN5_N: DRS4 (R346.2 U36.14), DRS-Module 0/FE5 (R161G.2 R167G.2)
DRS4_IN5_P: DRS4 (R346.1 U36.13), DRS-Module 0/FE5 (R160G.2 R166G.2)
DRS4_IN6_N: DRS4 (R347.2 U36.16), DRS-Module 0/FE6 (R161D.2 R167D.2)
DRS4_IN6_P: DRS4 (R347.1 U36.15), DRS-Module 0/FE6 (R160D.2 R166D.2)
DRS4_IN7_N: DRS4 (R348.2 U36.18), DRS-Module 0/FE7 (R161H.2 R167H.2)
DRS4_IN7_P: DRS4 (R348.1 U36.17), DRS-Module 0/FE7 (R160H.2 R166H.2)
DRS4_IN8_N: DRS4 (R349.2 U36.21), ANA_FE_CLK_SYNTH (R176.2 R183.2)
DRS4_IN8_P: DRS4 (R349.1 U36.20), ANA_FE_CLK_SYNTH (R175.2 R182.2)
DRS4_OUT8_N: DRS4 (U36.38), DRS4_ADC (R127.1)
DRS4_OUT8_P: DRS4 (U36.37), DRS4_ADC (R361.1)
DRS4_PLLLCK: DRS4 (R344.1 R362.1), MarsCarrier (J7.25)
DRS4_RSRLOAD: DRS4 (R163.1 U36.29), MarsCarrier (J7.103)
DRS4_SRCLK: DRS4 (R115.1 R312.1 U36.28), MarsCarrier (J7.105)
DRS4_SRIN: DRS4 (R315.1 U36.27), MarsCarrier (J7.113)
DRS4_SROUT: DRS4 (R179.1 U36.26), MarsCarrier (J7.115)
DRS4_WSRIN: DRS4 (R59.1 U36.75), MarsCarrier (J7.17)
DRS4_WSROUT: DRS4 (R60.1 U36.25), MarsCarrier (J7.119)
ETH_A_N: MarsCarrier (J7.169), ENET (D85.5 T1.11)
ETH_A_P: MarsCarrier (J7.171), ENET (D85.4 T1.10)
ETH_B_N: MarsCarrier (J7.177), ENET (D85.2 T1.5)
ETH_B_P: MarsCarrier (J7.179), ENET (D85.1 T1.4)
ETH_C_N: MarsCarrier (J7.183), ENET (D19.5 T1.3)
ETH_C_P: MarsCarrier (J7.185), ENET (D19.4 T1.2)
ETH_CTREF: MarsCarrier (J7.181), ENET (R75.2)
ETH_D_N: MarsCarrier (J7.191), ENET (D19.2 T1.9)
ETH_D_P: MarsCarrier (J7.193), ENET (D19.1 T1.8)
ETH_LED1#: MarsCarrier (J7.173), ENET (R76.2)
ETH_LED2#: MarsCarrier (J7.175), ENET (R77.2)
FPGA_DONE: MarsCarrier (J7.194), MarsCarrier_PWR (Q4.2 R34.2)
GPIO0_N: MarsCarrier (J7.125), MARS_GPIO_MISC (D45.4 J14.3)
GPIO0_P: MarsCarrier (J7.123), MARS_GPIO_MISC (D45.6 J14.1)
GPIO1_N: MarsCarrier (J7.131), MARS_GPIO_MISC (D45.3 J14.7)
GPIO1_P: MarsCarrier (J7.129), MARS_GPIO_MISC (D45.1 J14.5)
GPIO2_N: MarsCarrier (J7.135), MARS_GPIO_MISC (D46.4 J14.11)
GPIO2_P: MarsCarrier (J7.133), MARS_GPIO_MISC (D46.6 J14.9)
GPIO3_N: MarsCarrier (J7.104), MARS_GPIO_MISC (D46.3 J14.15)
GPIO3_P: MarsCarrier (J7.102), MARS_GPIO_MISC (D46.1 J14.13)
GPIO4_N: MarsCarrier (J7.110), MARS_GPIO_MISC (D47.4 J14.19)
GPIO4_P: MarsCarrier (J7.108), MARS_GPIO_MISC (D47.6 J14.17)
GPIO5_N: MarsCarrier (J7.114), MARS_GPIO_MISC (D47.3 J14.23)
GPIO5_P: MarsCarrier (J7.112), MARS_GPIO_MISC (D47.1 J14.21)
GPIO6_N: MarsCarrier (J7.120), MARS_GPIO_MISC (D48.4 J14.27)
GPIO6_P: MarsCarrier (J7.118), MARS_GPIO_MISC (D48.6 J14.25)
GPIO7_N: MarsCarrier (J7.124), MARS_GPIO_MISC (D48.3 J14.31)
GPIO7_P: MarsCarrier (J7.122), MARS_GPIO_MISC (D48.1 J14.29)
GPIO8_N: MarsCarrier (J7.134), MARS_GPIO_MISC (D49.4 J14.35)
GPIO8_P: MarsCarrier (J7.132), MARS_GPIO_MISC (D49.6 J14.33)
GPIO9_N: MarsCarrier (J7.140), MARS_GPIO_MISC (D49.3 J14.39)
GPIO9_P: MarsCarrier (J7.138), MARS_GPIO_MISC (D49.1 J14.37)
HMC849:EN0: DRS-Module 0/FE0 (U44A.5), DRS4_GPIO_EXPANDER (R79.2), GPIO_EXPANDER_LED (R281.2)
HMC849:EN1: DRS-Module 0/FE1 (U44E.5), DRS4_GPIO_EXPANDER (R82.2), GPIO_EXPANDER_LED (R282.2)
HMC849:EN2: DRS-Module 0/FE2 (U44B.5), DRS4_GPIO_EXPANDER (R84.2), GPIO_EXPANDER_LED (R283.2)
HMC849:EN3: DRS-Module 0/FE3 (U44F.5), DRS4_GPIO_EXPANDER (R86.2), GPIO_EXPANDER_LED (R284.2)
HMC849:EN4: DRS-Module 0/FE4 (U44C.5), DRS4_GPIO_EXPANDER (R88.2), GPIO_EXPANDER_LED (R297.2)
HMC849:EN5: DRS-Module 0/FE5 (U44G.5), DRS4_GPIO_EXPANDER (R90.2), GPIO_EXPANDER_LED (R298.2)
HMC849:EN6: DRS-Module 0/FE6 (U44D.5), DRS4_GPIO_EXPANDER (R92.2), GPIO_EXPANDER_LED (R299.2)
HMC849:EN7: DRS-Module 0/FE7 (U44H.5), DRS4_GPIO_EXPANDER (R94.2), GPIO_EXPANDER_LED (R300.2)
HMC849:EN8: ANA_FE_CLK_SYNTH (U45.5), DRS4_GPIO_EXPANDER (R96.2)
HMC849:VCTL0: DRS-Module 0/FE0 (U44A.2), DRS4_GPIO_EXPANDER (R81.2), GPIO_EXPANDER_LED (R285.1)
HMC849:VCTL1: DRS-Module 0/FE1 (U44E.2), DRS4_GPIO_EXPANDER (R83.2), GPIO_EXPANDER_LED (R286.1)
HMC849:VCTL2: DRS-Module 0/FE2 (U44B.2), DRS4_GPIO_EXPANDER (R85.2), GPIO_EXPANDER_LED (R287.1)
HMC849:VCTL3: DRS-Module 0/FE3 (U44F.2), DRS4_GPIO_EXPANDER (R87.2), GPIO_EXPANDER_LED (R288.1)
HMC849:VCTL4: DRS-Module 0/FE4 (U44C.2), DRS4_GPIO_EXPANDER (R89.2), GPIO_EXPANDER_LED (R301.1)
HMC849:VCTL5: DRS-Module 0/FE5 (U44G.2), DRS4_GPIO_EXPANDER (R91.2), GPIO_EXPANDER_LED (R302.1)
HMC849:VCTL6: DRS-Module 0/FE6 (U44D.2), DRS4_GPIO_EXPANDER (R93.2), GPIO_EXPANDER_LED (R303.1)
HMC849:VCTL7: DRS-Module 0/FE7 (U44H.2), DRS4_GPIO_EXPANDER (R95.2), GPIO_EXPANDER_LED (R304.1)
HMC849:VCTL8: ANA_FE_CLK_SYNTH (U45.2), DRS4_GPIO_EXPANDER (R97.2)
I2C_SCL: MarsCarrier (J7.178), MARS_MIO (D44.1 R220.2)
I2C_SDA: MarsCarrier (J7.176), MARS_MIO (D43.1 R219.2)
~{IN}~{_OFS}: DRS-Module 0/FE0 (L3A.1), DRS-Module 0/FE2 (L3B.1), DRS-Module 0/FE4 (L3C.1), DRS-Module 0/FE6 (L3D.1), DRS-Module 0/FE1 (L3E.1), DRS-Module 0/FE3 (L3F.1), DRS-Module 0/FE5 (L3G.1), DRS-Module 0/FE7 (L3H.1), ANA_FE_CLK_SYNTH (L5.1), DAC (R271.2)
IN+_OFS: DRS-Module 0/FE0 (L2A.2), DRS-Module 0/FE2 (L2B.2), DRS-Module 0/FE4 (L2C.2), DRS-Module 0/FE6 (L2D.2), DRS-Module 0/FE1 (L2E.2), DRS-Module 0/FE3 (L2F.2), DRS-Module 0/FE5 (L2G.2), DRS-Module 0/FE7 (L2H.2), ANA_FE_CLK_SYNTH (L4.2), DAC (R272.2)
IO_B34_L7_Y16_P: DRS4_ADC (R143.2), MarsCarrier (J7.59)
IO_B34_L7_Y17_N: DRS4_ADC (R142.2), MarsCarrier (J7.61)
IO_B34_L10_V15_P: DRS4_ADC (R146.2), MarsCarrier (J7.55)
IO_B34_L10_W15_N: DRS4_ADC (R145.2), MarsCarrier (J7.57)
IO_B34_L17_Y18_P: DRS4_ADC (R141.2), MarsCarrier (J7.65)
IO_B34_L17_Y19_N: DRS4_ADC (R139.2), MarsCarrier (J7.67)
IO_B34_L19_R17_N: DRS4_ADC (R147.2), MarsCarrier (J7.37)
IO_B34_L22_W18_P: DRS4_ADC (R138.2), MarsCarrier (J7.69)
IO_B34_L22_W19_N: DRS4_ADC (R137.2), MarsCarrier (J7.71)
IO_B35_L3_N: ToF (J1.8), MarsCarrier (D21.6 J7.144)
IO_B35_L3_P: ToF (J1.6), MarsCarrier (D21.1 J7.142)
IO_B35_L7_M19_P: DRS4_ADC (R132.2), MarsCarrier (J7.79)
IO_B35_L7_M20_N: DRS4_ADC (R130.2), MarsCarrier (J7.81)
IO_B35_L9_L19_P: DRS4_ADC (R128.2), MarsCarrier (J7.91)
IO_B35_L15_AD12_F20_N: MarsCarrier (J7.121), DRS4_GPIO_EXPANDER (R333.1)
IO_B35_L21_N15_P: DRS4_ADC (R136.2), MarsCarrier (J7.75)
IO_B35_L21_N16_N: DRS4_ADC (R134.2), MarsCarrier (J7.77)
IO_MIO41_B13_L16_W9: MarsCarrier (J7.141), MARS_MIO (R158.2 R369.2)
IO_MIO42_B13_L18_W11: MarsCarrier (J7.143), MARS_MIO (R370.2 R372.2)
IO_MIO43_B13_L18_Y11: MarsCarrier (J7.145), MARS_MIO (R373.2 R375.2)
IO_MIO44_B13_L14_SRCC_Y9: MarsCarrier (J7.149), MARS_MIO (R376.2 R378.2)
IO_MIO45_B13_L14_Y8: MarsCarrier (J7.151), MARS_MIO (R379.2 R381.2)
IO_MIO46_B13_L19_T5: MarsCarrier (J7.153), MARS_FTDI (R190.2 R191.2)
IO_MIO47_B13_L19_U5: MarsCarrier (J7.155), MARS_FTDI (R189.2 R192.2)
MCLK_N: ToF (J1.4), CLK_SYNTH (C88.1 D8.7)
MCLK_P: ToF (J1.2), CLK_SYNTH (C86.1 D8.9)
OUT0A_N: MarsCarrier (J7.6), CLK_SYNTH (U19.20)
OUT0A_P: MarsCarrier (J7.4), CLK_SYNTH (U19.21)
OUT1_N: DRS4 (R106.2 U36.67), CLK_SYNTH (U19.27)
OUT1_P: DRS4 (R106.1 U36.66), CLK_SYNTH (U19.28)
OUT9_N: ToF (J1.1), CLK_SYNTH (D8.3 U19.55)
OUT9_P: ToF (J1.3), CLK_SYNTH (D8.1 U19.56)
POR: MarsCarrier (J7.196), MarsCarrier_PWR (C76.1 S2.1 S2.2), MARS_PORB (R388.1)
POWER_EN: MarsCarrier (J7.13), MarsCarrier_PWR (R30.2), MARS_PORB (C64.1 R364.1 R366.1 U17.1)
POWER_GOOD: MarsCarrier (J7.40), MarsCarrier_PWR (Q4.5 R30.1)
PS_SRST#: MarsCarrier (J7.192), MarsCarrier_PWR (C71.1 S1.1 S1.2)
R-OFS: DRS4 (5 pins), DAC (U56.18)
~{SHDN}: DAC (OP3.5 OP3.6 OP4.6), DRS4_GPIO_EXPANDER (U20.66), GPIO_EXPANDER_LED (R320.2)
SCL: MARS_MIO (R100.1 R220.1), I2C_ISOLATION (U58.2 U59.2), I2C_MULTIPLEX (U63.19 U64.19)
SCL_3V3_INA226: Sensors (U47.5), I2C_MULTIPLEX (R269.1 U64.11)
SCL_4V_INA226: Sensors (U48.2 U48.5), I2C_MULTIPLEX (R334.1 U64.17)
SCL_-1V_INA226: Sensors (U49.5), I2C_MULTIPLEX (R336.1 U64.15)
SCL_ADCINA226_AVDD: DRS4_ADC (U43.1 U43.2 U43.5), I2C_MULTIPLEX (R258.1 U63.13)
SCL_ADCINA226_DVDD: DRS4_ADC (U41.5), I2C_MULTIPLEX (R251.1 U63.8)
SCL_ADCTMP112: DRS4_ADC (U42.1), I2C_MULTIPLEX (R253.1 U63.11)
SCL_BME280: Sensors (U52.4), I2C_MULTIPLEX (R261.1 U64.2)
SCL_ClkSensorTMP112: Sensors (U51.1 U51.4), I2C_MULTIPLEX (R69.1 U63.2)
SCL_CY8C9560A: DRS4_GPIO_EXPANDER (U20.24), I2C_MULTIPLEX (R254.1 U63.17)
SCL_DAC: DAC (U56.3), I2C_MULTIPLEX (R74.1 U63.6)
SCL_DRS4INA226: DRS4 (U38.1 U38.5), I2C_MULTIPLEX (R267.1 U64.8)
SCL_DRS4INA226_AVDD: DRS4 (U37.5), I2C_MULTIPLEX (R256.1 U63.15)
SCL_DRS4TMP112: DRS4 (U39.1), I2C_MULTIPLEX (R265.1 U64.6)
SCL_LIS3MDLTR: Sensors (U50.1), I2C_MULTIPLEX (R263.1 U64.4)
SCL_SI5395: CLK_SYNTH (U19.16), I2C_MULTIPLEX (R72.1 U63.4)
SCL_Zynq_INA226: MarsCarrier_PWR (U16.5), I2C_MULTIPLEX (R338.1 U64.13)
SDA: MARS_MIO (R99.1 R219.1), I2C_ISOLATION (U58.3 U59.3), I2C_MULTIPLEX (U63.20 U64.20)
SDA_3V3_INA226: Sensors (U47.4), I2C_MULTIPLEX (R268.1 U64.10)
SDA_4V_INA226: Sensors (U48.4), I2C_MULTIPLEX (R335.1 U64.16)
SDA_-1V_INA226: Sensors (U49.4), I2C_MULTIPLEX (R337.1 U64.14)
SDA_ADCINA226_AVDD: DRS4_ADC (U43.4), I2C_MULTIPLEX (R259.1 U63.12)
SDA_ADCINA226_DVDD: DRS4_ADC (U41.2 U41.4), I2C_MULTIPLEX (R250.1 U63.7)
SDA_ADCTMP112: DRS4_ADC (U42.4 U42.6), I2C_MULTIPLEX (R252.1 U63.10)
SDA_BME280: Sensors (U52.3), I2C_MULTIPLEX (R260.1 U64.1)
SDA_ClkSensorTMP112: Sensors (U51.6), I2C_MULTIPLEX (R68.1 U63.1)
SDA_CY8C9560A: DRS4_GPIO_EXPANDER (U20.28), I2C_MULTIPLEX (R255.1 U63.16)
SDA_DAC: DAC (U56.13), I2C_MULTIPLEX (R73.1 U63.5)
SDA_DRS4INA226: DRS4 (U38.2 U38.4), I2C_MULTIPLEX (R266.1 U64.7)
SDA_DRS4INA226_AVDD: DRS4 (U37.4), I2C_MULTIPLEX (R257.1 U63.14)
SDA_DRS4TMP112: DRS4 (U39.6), I2C_MULTIPLEX (R264.1 U64.5)
SDA_LIS3MDLTR: Sensors (U50.11), I2C_MULTIPLEX (R262.1 U64.3)
SDA_SI5395: CLK_SYNTH (U19.18), I2C_MULTIPLEX (R71.1 U63.3)
SDA_Zynq_INA226: MarsCarrier_PWR (U16.4), I2C_MULTIPLEX (R339.1 U64.12)
SDIO_CLK: MarsCarrier (R360.2), MARS_MIO (U53.9)
Si5395_FDEC: CLK_SYNTH (U19.25), DRS4_GPIO_EXPANDER (U20.10), GPIO_EXPANDER_LED (R314.1)
Si5395_FINC: CLK_SYNTH (U19.48), DRS4_GPIO_EXPANDER (U20.7), GPIO_EXPANDER_LED (R311.2)
Si5395_~{OE}: CLK_SYNTH (U19.11), DRS4_GPIO_EXPANDER (U20.9), GPIO_EXPANDER_LED (R317.1)
Si5395_~{RST}: CLK_SYNTH (U19.6), DRS4_GPIO_EXPANDER (U20.8), GPIO_EXPANDER_LED (R319.2)
TC_0: DRS-Module 0/FE0 (C211A.2), TCA_LP_FILTER (R223.2 R226.2)
TC_1: DRS-Module 0/FE1 (C211E.2), TCA_LP_FILTER (R229.2 R232.2)
TC_2: DRS-Module 0/FE2 (C211B.2), TCA_LP_FILTER (R235.2 R238.2)
TC_3: DRS-Module 0/FE3 (C211F.2), TCA_LP_FILTER (R241.2 R244.2)
TC_4: DRS-Module 0/FE4 (C211C.2), TCA_LP_FILTER (R247.2 R249.2)
TC_5: DRS-Module 0/FE5 (C211G.2), TCA_LP_FILTER (R224.2 R228.2)
TC_6: DRS-Module 0/FE6 (C211D.2), TCA_LP_FILTER (R230.2 R233.2)
TC_7: DRS-Module 0/FE7 (C211H.2), TCA_LP_FILTER (R236.2 R239.2)
TC_8: ANA_FE_CLK_SYNTH (C234.2), TCA_LP_FILTER (R242.2 R246.2)
TCA_CLK0: TCA_CLK_DIST (R354.2), TCA_LP_FILTER (C293.2 L10.1)
TCA_CLK1: TCA_CLK_DIST (R353.2), TCA_LP_FILTER (C301.2 L16.1)
TCA_CLK2: TCA_CLK_DIST (R352.2), TCA_LP_FILTER (C309.2 L22.1)
TCA_CLK3: TCA_CLK_DIST (R351.2), TCA_LP_FILTER (C317.2 L28.1)
TCA_CLK4: TCA_CLK_DIST (R350.2), TCA_LP_FILTER (C325.2 L34.1)
TCA_CLK5: TCA_CLK_DIST (R358.2), TCA_LP_FILTER (C297.2 L13.1)
TCA_CLK6: TCA_CLK_DIST (R357.2), TCA_LP_FILTER (C305.2 L19.1)
TCA_CLK7: TCA_CLK_DIST (R356.2), TCA_LP_FILTER (C313.2 L25.1)
TCA_CLK8: TCA_CLK_DIST (R355.2), TCA_LP_FILTER (C321.2 L31.1)
TCA_CLK_0T05_EN: TCA_CLK_DIST (U55.1), DRS4_GPIO_EXPANDER (U20.37), GPIO_EXPANDER_LED (R316.1)
TCA_CLK_6T08_EN: TCA_CLK_DIST (U55.18), DRS4_GPIO_EXPANDER (U20.36), GPIO_EXPANDER_LED (R313.2)
V_CM: DRS-Module 0/FE0 (C205A.1 C208A.1 OP1A.4 OP1A.9), DRS-Module 0/FE2 (C205B.1 C208B.1 OP1B.4 OP1B.9), DRS-Module 0/FE4 (C205C.1 C208C.1 OP1C.4 OP1C.9), DRS-Module 0/FE6 (C205D.1 C208D.1 OP1D.4 OP1D.9), DRS-Module 0/FE1 (C205E.1 C208E.1 OP1E.4 OP1E.9), DRS-Module 0/FE3 (C205F.1 C208F.1 OP1F.4 OP1F.9), DRS-Module 0/FE5 (C205G.1 C208G.1 OP1G.4 OP1G.9), DRS-Module 0/FE7 (C205H.1 C208H.1 OP1H.4 OP1H.9), ANA_FE_CLK_SYNTH (C228.1 C231.1 OP2.4 OP2.9), DAC (R270.2)
VCAL_RESET: DAC (U56.14), DRS4_GPIO_EXPANDER (R98.1), GPIO_EXPANDER_LED (R318.1)